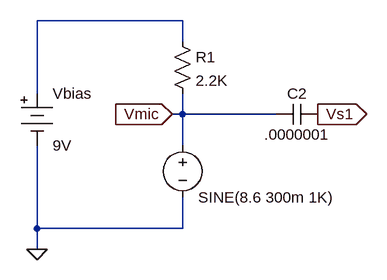
[diagram p0: schematic AudioAmplifier lab.asc]
AudioAmplifier lab.asc, the LTspice schematic file:
Version 4
SHEET 1 880 680
WIRE 352 128 128 128
WIRE 352 160 352 128
WIRE 128 240 128 128
WIRE 352 272 352 240
WIRE 352 272 336 272
WIRE 496 272 352 272
WIRE 352 320 352 272
WIRE 128 448 128 320
WIRE 352 448 352 400
WIRE 352 448 128 448
WIRE 128 480 128 448
FLAG 128 480 0
FLAG 336 272 Vmic
IOPIN 336 272 In
FLAG 560 272 Vs1
IOPIN 560 272 Out
SYMBOL Misc/battery 128 224 R0
SYMATTR InstName Vbias
SYMATTR Value 9V
SYMBOL res 336 144 R0
SYMATTR InstName R1
SYMATTR Value 2.2K
SYMBOL voltage 352 304 R0
WINDOW 0 24 16 Invisible 2
SYMATTR InstName V1
SYMATTR Value SINE(8.6 300m 1K)
SYMBOL cap 560 256 R90
WINDOW 0 0 32 VBottom 2
WINDOW 3 32 32 VTop 2
SYMATTR InstName C2
SYMATTR Value .0000001

The netlist it stands for:
* AudioAmplifier lab.asc
Vbias N001 0 9V
R1 N001 Vmic 2.2K
V1 Vmic 0 SINE(8.6 300m 1K)
C2 Vs1 Vmic .0000001
.backanno
.end